# Altium schematic sheet PDOC.SchDoc
size A4; SheetNumber: 8; SheetTotal: 11
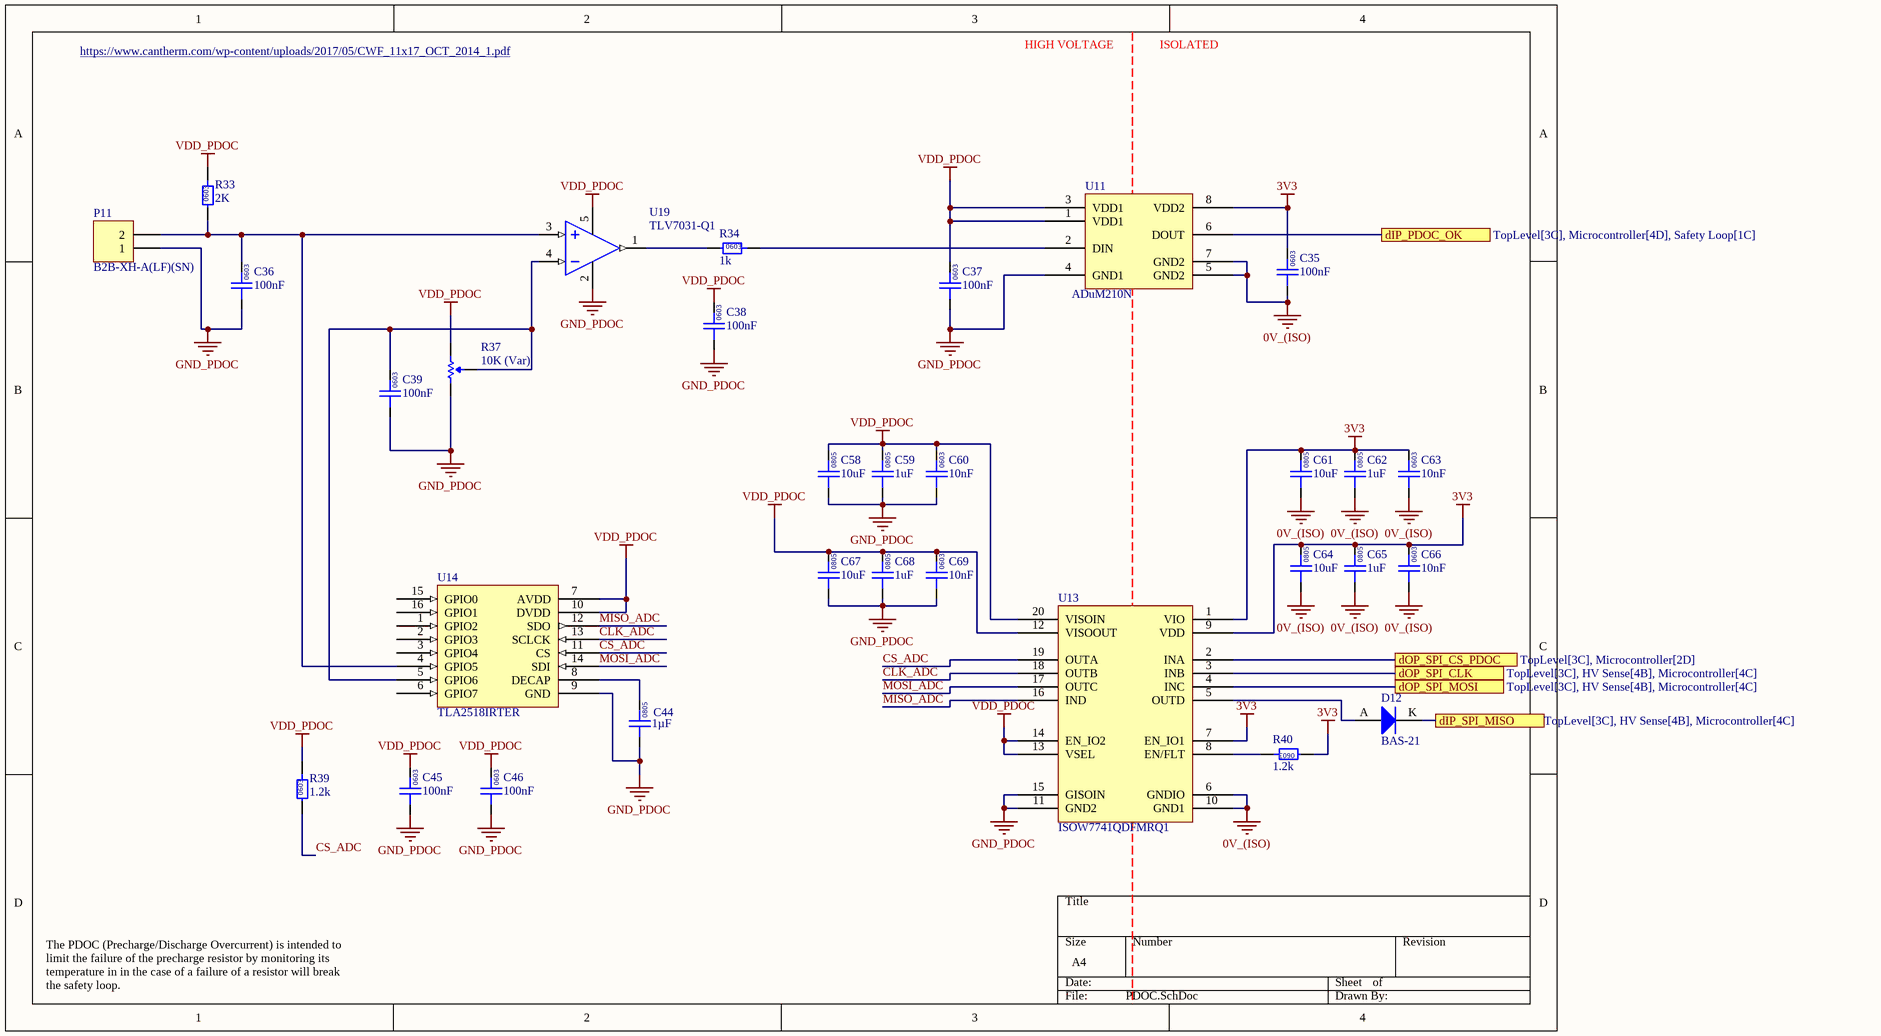
[diagram p0: PDOC.SchDoc]

## Parts
C35  100nF  [0603]
C36  100nF  [0603]
C37  100nF  [0603]
C38  100nF  [0603]
C39  100nF  [0603]
C44  1µF  [0805]
C45  100nF  [0603]
C46  100nF  [0603]
C58  10uF  [GCM21BR71H105KA03L-Footprint-1]
C59  1uF  [GCM21BR71H105KA03L-Footprint-1]
C60  10nF  [0603 Capacitor]
C61  10uF  [GCM21BR71H105KA03L-Footprint-1]
C62  1uF  [GCM21BR71H105KA03L-Footprint-1]
C63  10nF  [0603 Capacitor]
C64  10uF  [GCM21BR71H105KA03L-Footprint-1]
C65  1uF  [GCM21BR71H105KA03L-Footprint-1]
C66  10nF  [0603 Capacitor]
C67  10uF  [GCM21BR71H105KA03L-Footprint-1]
C68  1uF  [GCM21BR71H105KA03L-Footprint-1]
C69  10nF  [0603 Capacitor]
D12  BAS-21  [NEXPERIA_SOT23]
P11  B2B-XH-A(LF)(SN)  [XH 2 PIN VERT]
R33  2K  [0603]
R34  1k  [0603]
R37  10K (Var)  [B 3296]
R39  1.2k  [0603]
R40  1.2k  [0603]
U11  ADuM210N  [SOIC-8W]
U13  ISOW7741QDFMRQ1  [TI-SOIC-20]
U14  TLA2518IRTER  [QFN50P300X300X80_HS-17N]
U19  TLV7031-Q1  [TI SOT-23-5]

## Ports
dIP_PDOC_OK (see TopLevel[3C], Microcontroller[4D], Safety Loop[1C]), dIP_SPI_MISO (see TopLevel[3C], HV Sense[4B], Microcontroller[4C]), dOP_SPI_CLK (see TopLevel[3C], HV Sense[4B], Microcontroller[4C]), dOP_SPI_CS_PDOC (see TopLevel[3C], Microcontroller[2D]), dOP_SPI_MOSI (see TopLevel[3C], HV Sense[4B], Microcontroller[4C])

## Nets
0V_(ISO): C35.1 C61.1 C62.1 C63.1 C64.1 C65.1 C66.1 U11.5(GND2) U11.7(GND2) U13.6(GNDIO) U13.10(GND1)
3V3: C35.2 C61.2 C62.2 C63.2 C64.2 C65.2 C66.2 R40.1 U11.8(VDD2) U13.1(VIO) U13.7(EN_IO1) U13.9(VDD)
GND_PDOC: C36.1 C37.1 C38.1 C39.1 C44.1 C45.1 C46.1 C58.1 C59.1 C60.1 C67.1 C68.1 C69.1 P11.1 R37.3(CW) U11.4(GND1) U13.11(GND2) U13.15(GISOIN) U14.9(GND) U19.2(V-)
VDD_PDOC: C37.2 C38.2 C45.2 C46.2 C58.2 C59.2 C60.2 C67.2 C68.2 C69.2 R33.2 R37.1(CCW) R39.2 U11.1(VDD1) U11.3(VDD1) U13.12(VISOOUT) U13.13(VSEL) U13.14(EN_IO2) U13.20(VISOIN) U14.7(AVDD) U14.10(DVDD) U19.5(Vcc)
CLK_ADC: U13.18(OUTB) U14.13(SCLCK)
CS_ADC: R39.1 U13.19(OUTA) U14.11(CS)
dIP_PDOC_OK: U11.6(DOUT) ; port dIP_PDOC_OK
dIP_SPI_MISO: D12.K ; port dIP_SPI_MISO
dOP_SPI_CLK: U13.3(INB) ; port dOP_SPI_CLK
dOP_SPI_CS_PDOC: U13.2(INA) ; port dOP_SPI_CS_PDOC
dOP_SPI_MOSI: U13.4(INC) ; port dOP_SPI_MOSI
MISO_ADC: U13.16(IND) U14.12(SDO)
MOSI_ADC: U13.17(OUTC) U14.14(SDI)
NetC36_2: C36.2 P11.2 R33.1 U14.4(GPIO5) U19.3(IN+)
NetC39_2: C39.2 R37.2(Wiper) U14.5(GPIO6) U19.4(IN-)
NetC44_2: C44.2 U14.8(DECAP)
NetD12_A: D12.A U13.5(OUTD)
NetR34_1: R34.1 U19.1(OUT)
NetR34_2: R34.2 U11.2(DIN)
NetR40_2: R40.2 U13.8(EN/FLT)

Not connected (* = marked no-connect by the designer): U14 1(GPIO2) 2(GPIO3) 3(GPIO4) 6(GPIO7) 15(GPIO0) 16(GPIO1)

## Notes on the sheet
- https://www.cantherm.com/wp-content/uploads/2017/05/CWF_11x17_OCT_2014_1.pdf
- HIGH VOLTAGE
- ISOLATED
- The PDOC (Precharge/Discharge Overcurrent) is intended to limit the failure of the precharge resistor by monitoring its temperature in in the case of a failure of a resistor will break the safety loop.
- (in symbol CMP-102-000028-7) 0603
- (in symbol CMP-102-000033-3) 0805
- (in symbol CMP-102-000034-2) 0805
- (in symbol GCM21BR71H105KA03L) 0805
- (in symbol GCM188L81H104KA57D) 0603
- (in symbol RC0603FR-071KL) 0603
- (in symbol RC0603FR-072KL) 0603
- (in symbol RC0603JR-071K2L) 0603

## Library data of the parts
C35-C39 C45 C46 = GCM188L81H104KA57D: Manufacturer: muRata; Rated Voltage: 50V; Tolerance: ±10%; Material: MLCC; Temperature Rating: X8L; Part Number: GCM188L81H104KA57D; Value: 100nF; Digikey Part Number: 490-6049-1-ND
C44 = GCM21BR71H105KA03L: Manufacturer: muRata; Rated Voltage: 50V; Tolerance: ±10%; Material: MLCC; Temperature Rating: X7R; Part Number: GCM21BR71H105KA03L; Value: 1µF; Digikey Part Number: 490-10675-1-ND
C58 C61 C64 C67 = CMP-102-000034-2: Ceramic Capacitor, Multilayer, Ceramic, 35V, 10% +Tol, 10% -Tol, X5R, 15% TC, 10uF, Surface Mount, 0805; Part Number: GRM21BR6YA106KE43L; Value: 10µF; Material: X7R; Tolerance: 10%; Rated Voltage: 35V; Digikey Link: https://www.digikey.com.au/en/products/detail/murata-electronics/GRM21BR6YA106KE43L/5027598?s=N4IgTCBcDaIOICUCyYCMAhBA2AmgQVQAYsBpAUQBYBmAGQAIQBdAXyA
C59 C62 C65 C68 = CMP-102-000033-3: Ceramic Capacitor, Multilayer, Ceramic, 50V, 10% +Tol, 10% -Tol, X7R, 15% TC, 1uF, Surface Mount, 0805; Part Number: GCM21BR71H105KA03L; Value: 1µF; Rated Voltage: 50V; Digikey Link: https://www.digikey.com.au/en/products/detail/murata-electronics/GCM21BR71H105KA03L/4903984?s=N4IgTCBcDaIOIGECyYCMAhASgdlQCVQAYBWAaQEFCBmAGRAF0BfIA; Tolerance: 10%; Material: X7R
C60 C63 C66 C69 = CMP-102-000028-7: Ceramic Capacitor, Multilayer, Ceramic, 50V, 5% +Tol, 5% -Tol, C0G, 30ppm/Cel TC, 0.01uF, Surface Mount, 0603; Part Number: GCM1885C1H103JA16D; Value: 10nF; Material: C0G; Rated Voltage: 50V; Tolerance: 5%; Digikey Link: https://www.digikey.com.au/en/products/detail/murata-electronics/GCM1885C1H103JA16D/13401923?s=N4IgTCBcDaIOIGECyBGAHGgrAlAJFADAMwBSAgigGwAiIAugL5A
D12 = BAS-21: Manufacturer: Nexperia USA Inc.; Forward Voltage: 1.0V; Breakdown Voltage: 250V; Rated Power: 250mW; Part Number: BAS-21
P11 = B2B-XH-A(LF)(SN): Positions: 2; Pitch: 2.54mm; Angle: 0; Flange: No; Contact: Tin; Part Number: B2B-XH-A(LF)(SN); Row Spacing: 2.54mm; Digikey Part Number: 455-2247-ND; Digikey Link: https://www.digikey.com.au/en/products/detail/jst-sales-america-inc/B2B-XH-A-LF-SN/1651045
R33 = RC0603FR-072KL: Manufacturer: YAGEO; Tolerance: 0.01; Rated Power: 0.1W; Part Number: RC0603FR-072KL; Value: 2K; Digikey Part Number: 311-2.00KHRCT-ND; Material: FR-07
R34 = RC0603FR-071KL: Manufacturer: YAGEO; Tolerance: 0.01; Rated Power: 0.1W; Part Number: RC0603FR-071KL; Value: 1k; Digikey Part Number: 311-1.00KHRCT-ND; Material: FR-07
R37 = 3296W-1-103LF: Manufacturer: Bournes Inc; Tolerance: 0.1; Rated Power: 0.5W; Part Number: 3296W-1-103LF; Value: 10K (Var); Digikey Part Number: 3296W-103LF-ND
R39 R40 = RC0603JR-071K2L: Manufacturer: YAGEO; Tolerance: 0.01; Rated Power: 0.1W; Part Number: RC0603JR-071K2L; Value: 1.2k; Material: FR-07; Digikey Part Number: 311-1.2KGRCT-ND
U11 = CMP-110-000007-1: DIGITAL ISOLATOR, SINGLE CHANNEL; Digikey Link: #https://www.analog.com/media/en/technical-documentation/data-sheets/ADuM210N.pdf#; Part Number: ADuM210N
U13 = CMP-001-0030-1: Automotive, low-emissions, quad-channel 3/1 reinforced digital isolator with integrated power 20-SOIC -40 to 125
U14 = CMP-001-0002-15: 8-Channel Single ADC SAR 1Msps 12-bit Serial 16-Pin WQFN EP T/R; Digikey Link: https://www.digikey.com.au/en/products/detail/texas-instruments/ADS7028IRTER/12696020?s=N4IgTCBcDaIIIBEDKB2ADGAHASQEoBUBRXEAXQF8g
U19 = TLV7031-Q1: Manufacturer: Texas Instruments; Input Voltage: 1.6 to 6.5 V; Channels: 1; Output: Push-Pull; Part Number: TLV7031-Q1; Digikey Part Number: 296-TLV7031QDBVRQ1CT-ND